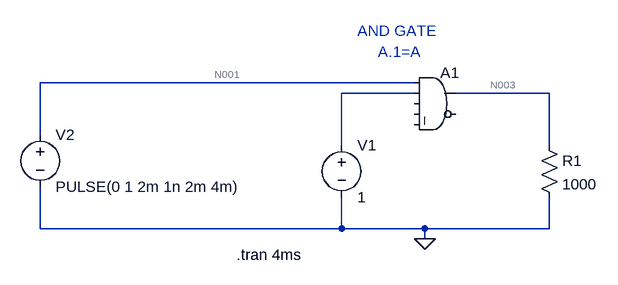
[diagram p0: schematic 4_A_dot_1_equal_A.asc]
4_A_dot_1_equal_A.asc, the LTspice schematic file:
Version 4
SHEET 1 880 680
WIRE 384 48 -192 48
WIRE 384 64 272 64
WIRE 592 64 448 64
WIRE -192 128 -192 48
WIRE 272 144 272 64
WIRE 592 144 592 64
WIRE -192 272 -192 208
WIRE 272 272 272 224
WIRE 272 272 -192 272
WIRE 400 272 272 272
WIRE 592 272 592 224
WIRE 592 272 400 272
WIRE 400 288 400 272
FLAG 400 288 0
SYMBOL voltage 272 128 R0
SYMATTR InstName V1
SYMATTR Value 1
SYMBOL voltage -192 112 R0
WINDOW 123 0 0 Left 0
WINDOW 39 0 0 Left 0
SYMATTR InstName V2
SYMATTR Value PULSE(0 1 2m 1n 2m 4m)
SYMBOL res 576 128 R0
SYMATTR InstName R1
SYMATTR Value 1000
SYMBOL Digital\\and 416 16 R0
SYMATTR InstName A1
TEXT 296 -32 Left 2 ;AND GATE
TEXT 110 312 Left 2 !.tran 4ms
TEXT 328 0 Left 2 ;A.1=A

The netlist it stands for:
* 4_A_dot_1_equal_A.asc
V1 N002 0 1
V2 N001 0 PULSE(0 1 2m 1n 2m 4m)
R1 N003 0 1000
A1 N001 N002 0 0 0 0 N003 0 AND
* AND GATE
.tran 4ms
* A.1=A
.backanno
.end

* Results of the author's LTspice run, read from the files saved beside the schematic
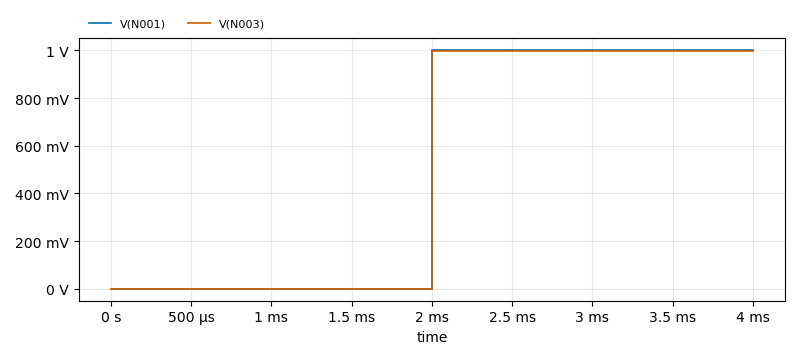
[diagram p1: Transient Analysis of 4_A_dot_1_equal_A.asc, plotted from the saved traces]
* Transient Analysis, 1 run:
*   V(N001): min 0 V, max 1 V, average 500 mV, rms 707.1 mV, last 1 V
*   V(N003): min 0 V, max 999 mV, average 499.5 mV, rms 706.4 mV, last 999 mV